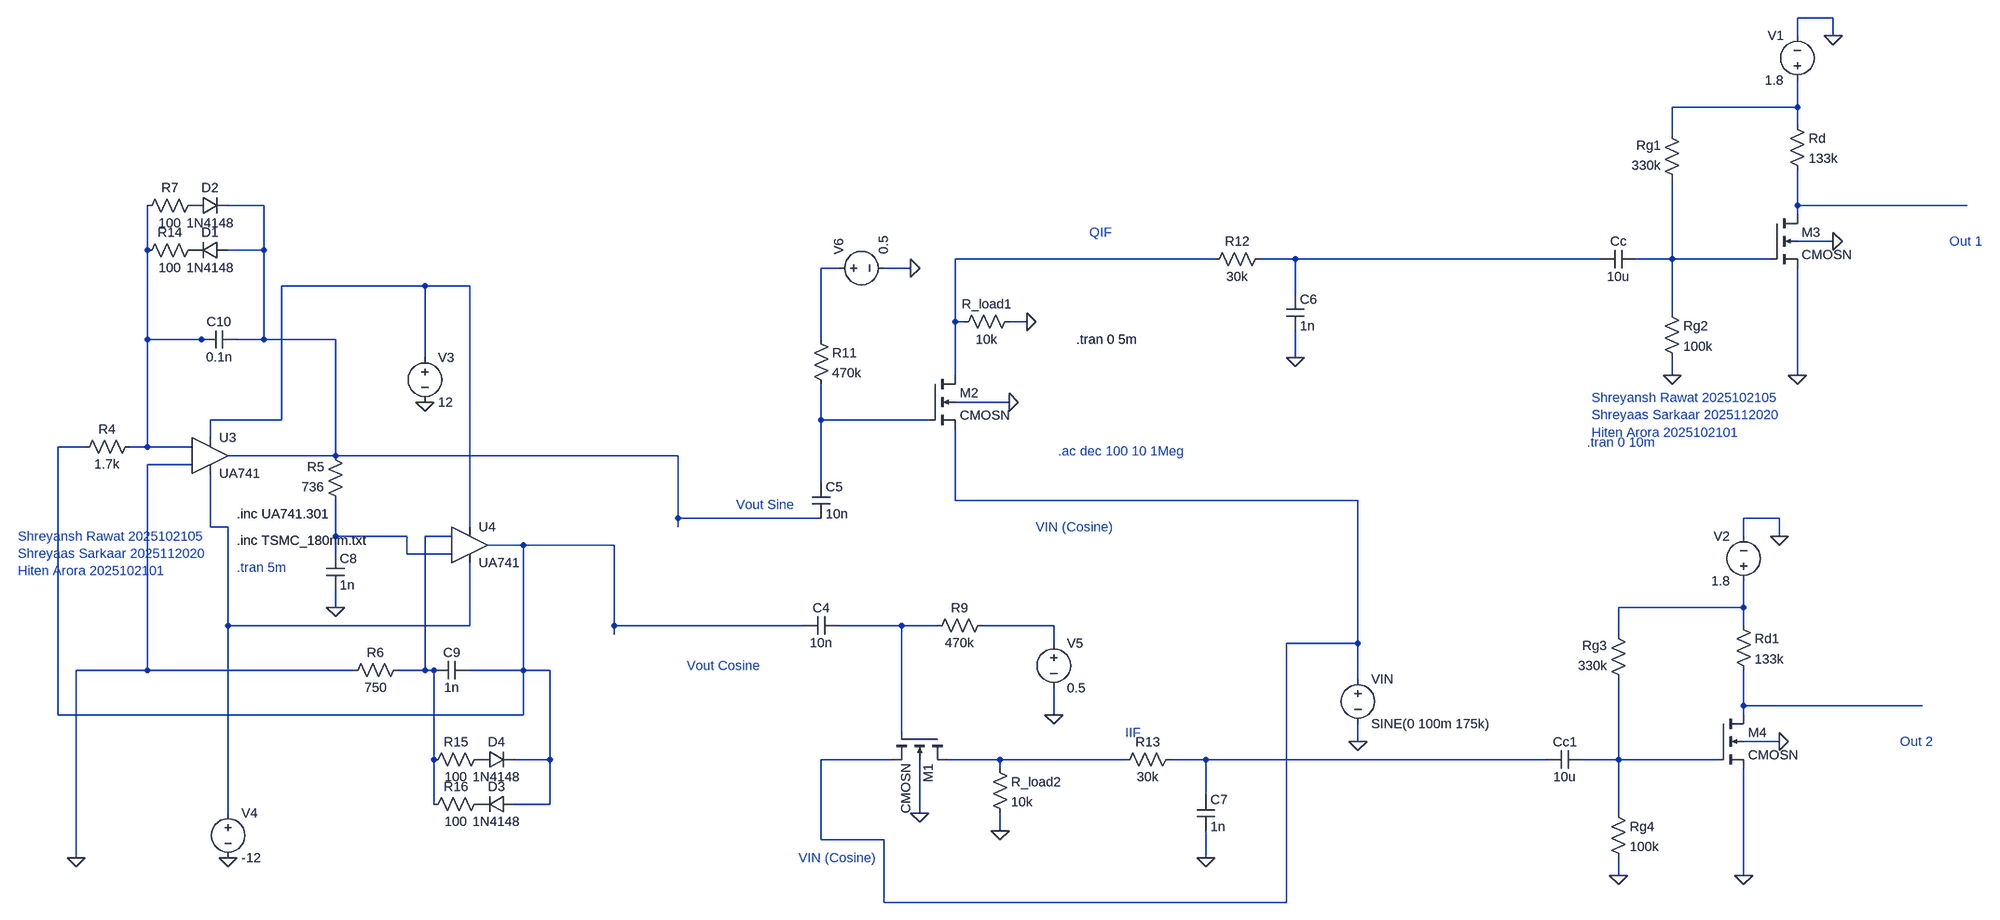
[diagram p0: schematic qdc_full_system.asc]
qdc_full_system.asc, the LTspice schematic file:
Version 4.1
SHEET 1 5124 900
WIRE 3616 -688 3552 -688
WIRE 3552 -656 3552 -688
WIRE 3616 -656 3616 -688
WIRE 3552 -528 3552 -576
WIRE 3552 -528 3328 -528
WIRE 3552 -496 3552 -528
WIRE 3328 -480 3328 -528
WIRE 224 -352 160 -352
WIRE 3552 -352 3552 -416
WIRE 3856 -352 3552 -352
WIRE 3552 -336 3552 -352
WIRE 3616 -288 3552 -288
WIRE 16 -272 16 -352
WIRE 224 -272 224 -352
WIRE 224 -272 160 -272
WIRE 2400 -256 1936 -256
WIRE 2544 -256 2480 -256
WIRE 3200 -256 2544 -256
WIRE 3328 -256 3328 -400
WIRE 3328 -256 3264 -256
WIRE 3504 -256 3328 -256
WIRE 1728 -240 1696 -240
WIRE 1856 -240 1808 -240
WIRE 512 -208 256 -208
WIRE 592 -208 512 -208
WIRE 2544 -192 2544 -256
WIRE 3328 -160 3328 -256
WIRE 1936 -144 1936 -256
WIRE 1952 -144 1936 -144
WIRE 2064 -144 2032 -144
WIRE 16 -112 16 -272
WIRE 112 -112 16 -112
WIRE 128 -112 112 -112
WIRE 224 -112 224 -272
WIRE 224 -112 176 -112
WIRE 352 -112 224 -112
WIRE 1696 -112 1696 -240
WIRE 512 -80 512 -208
WIRE 2544 -80 2544 -128
WIRE 1936 -48 1936 -144
WIRE 3328 -48 3328 -80
WIRE 3552 -48 3552 -240
WIRE 2032 0 1936 0
WIRE 256 32 256 -208
WIRE 256 32 128 32
WIRE 1696 32 1696 -32
WIRE 1888 32 1696 32
WIRE 128 64 128 32
WIRE -96 80 -144 80
WIRE 16 80 16 -112
WIRE 16 80 -16 80
WIRE 96 80 16 80
WIRE 352 96 352 -112
WIRE 352 96 160 96
WIRE 1440 96 352 96
WIRE 96 112 16 112
WIRE 1696 144 1696 32
WIRE 1936 176 1936 48
WIRE 2656 176 1936 176
WIRE 1440 208 1440 96
WIRE 1696 208 1440 208
WIRE 3520 208 3456 208
WIRE 128 224 128 128
WIRE 160 224 128 224
WIRE 592 224 592 -208
WIRE 1440 224 1440 208
WIRE 352 240 352 176
WIRE 480 240 352 240
WIRE 560 240 512 240
WIRE 3456 240 3456 208
WIRE 3520 240 3520 208
WIRE 688 256 624 256
WIRE 1312 256 688 256
WIRE 352 272 352 240
WIRE 480 272 480 240
WIRE 560 272 480 272
WIRE 352 368 352 336
WIRE 3456 368 3456 320
WIRE 3456 368 3232 368
WIRE 160 400 160 224
WIRE 592 400 592 288
WIRE 592 400 160 400
WIRE 1312 400 1312 256
WIRE 1664 400 1312 400
WIRE 1840 400 1728 400
WIRE 1904 400 1840 400
WIRE 2112 400 1984 400
WIRE 3456 400 3456 368
WIRE 1312 416 1312 400
WIRE 3232 416 3232 368
WIRE 2112 432 2112 400
WIRE 2656 432 2656 176
WIRE 2656 432 2528 432
WIRE 16 480 16 112
WIRE 16 480 -112 480
WIRE 384 480 16 480
WIRE 512 480 512 240
WIRE 512 480 464 480
WIRE 528 480 512 480
WIRE 688 480 688 256
WIRE 688 480 592 480
WIRE 736 480 688 480
WIRE 2656 496 2656 432
WIRE 3456 544 3456 480
WIRE 3776 544 3456 544
WIRE -144 560 -144 80
WIRE 688 560 688 480
WIRE 688 560 -144 560
WIRE 2112 560 2112 512
WIRE 3456 560 3456 544
WIRE 1840 592 1840 400
WIRE 2656 608 2656 576
WIRE 3520 608 3456 608
WIRE 528 640 528 480
WIRE 736 640 736 480
WIRE 736 640 672 640
WIRE 1824 640 1696 640
WIRE 2016 640 1920 640
WIRE 2240 640 2016 640
WIRE 2384 640 2320 640
WIRE 3104 640 2384 640
WIRE 3232 640 3232 496
WIRE 3232 640 3168 640
WIRE 3408 640 3232 640
WIRE 2016 656 2016 640
WIRE 2384 704 2384 640
WIRE 528 720 528 640
WIRE 736 720 736 640
WIRE 736 720 672 720
WIRE 160 736 160 400
WIRE 1872 736 1872 640
WIRE 3232 736 3232 640
WIRE 2016 768 2016 736
WIRE 1696 784 1696 640
WIRE 1808 784 1696 784
WIRE -112 816 -112 480
WIRE 2384 816 2384 768
WIRE 3232 848 3232 816
WIRE 3456 848 3456 656
WIRE 1808 896 1808 784
WIRE 2528 896 2528 432
WIRE 2528 896 1808 896
FLAG 1872 736 0
FLAG 2016 768 0
FLAG 2112 560 0
FLAG 2032 0 0
FLAG 2064 -144 0
FLAG 1856 -240 0
FLAG 2384 816 0
FLAG 2656 608 0
FLAG 352 368 0
FLAG 512 0 0
FLAG -112 816 0
FLAG 160 816 0
FLAG 3616 -656 0
FLAG 3616 -288 0
FLAG 3552 -48 0
FLAG 3328 -48 0
FLAG 3520 240 0
FLAG 3520 608 0
FLAG 3456 848 0
FLAG 3232 848 0
FLAG 2544 -80 0
DATAFLAG 3232 640 ""
DATAFLAG 3456 544 ""
DATAFLAG 2976 -256 ""
SYMBOL nmos4 1920 592 R90
SYMATTR InstName M1
SYMATTR Value CMOSN
SYMATTR Value2 l=180n w=2u ad=1.2p as=1.2p pd=5.2u ps=5.2u
SYMBOL res 2000 640 R0
SYMATTR InstName R_load2
SYMATTR Value 10k
SYMBOL res 2000 384 R90
WINDOW 0 0 56 VBottom 2
WINDOW 3 32 56 VTop 2
SYMATTR InstName R9
SYMATTR Value 470k
SYMBOL cap 1728 384 R90
WINDOW 0 0 32 VBottom 2
WINDOW 3 32 32 VTop 2
SYMATTR InstName C4
SYMATTR Value 10n
SYMBOL voltage 2112 416 R0
WINDOW 123 0 0 Left 0
WINDOW 39 0 0 Left 0
SYMATTR InstName V5
SYMATTR Value 0.5
SYMBOL nmos4 1888 -48 R0
SYMATTR InstName M2
SYMATTR Value CMOSN
SYMATTR Value2 l=180n w=2u ad=1.2p as=1.2p pd=5.2u ps=5.2u
SYMBOL res 1936 -128 R270
WINDOW 0 32 56 VTop 2
WINDOW 3 0 56 VBottom 2
SYMATTR InstName R_load1
SYMATTR Value 10k
SYMBOL res 1680 -128 R0
SYMATTR InstName R11
SYMATTR Value 470k
SYMBOL cap 1680 144 R0
SYMATTR InstName C5
SYMATTR Value 10n
SYMBOL voltage 1712 -240 R270
WINDOW 123 0 0 Left 0
WINDOW 39 0 0 Left 0
SYMATTR InstName V6
SYMATTR Value 0.5
SYMBOL voltage 2656 480 R0
WINDOW 123 24 124 Left 2
WINDOW 39 0 0 Left 0
SYMATTR InstName VIN
SYMATTR Value SINE(0 100m 175k)
SYMBOL res 2496 -272 R90
WINDOW 0 0 56 VBottom 2
WINDOW 3 32 56 VTop 2
SYMATTR InstName R12
SYMATTR Value 30k
SYMBOL cap 2528 -192 R0
SYMATTR InstName C6
SYMATTR Value 1n
SYMBOL res 2336 624 R90
WINDOW 0 0 56 VBottom 2
WINDOW 3 32 56 VTop 2
SYMATTR InstName R13
SYMATTR Value 30k
SYMBOL cap 2368 704 R0
SYMATTR InstName C7
SYMATTR Value 1n
SYMBOL UA741 128 32 R0
SYMATTR InstName U3
SYMBOL UA741 592 192 R0
SYMATTR InstName U4
SYMBOL res 0 64 R90
WINDOW 0 0 56 VBottom 2
WINDOW 3 32 56 VTop 2
SYMATTR InstName R4
SYMATTR Value 1.7k
SYMBOL res 368 192 R180
WINDOW 0 36 76 Left 2
WINDOW 3 36 40 Left 2
SYMATTR InstName R5
SYMATTR Value 736
SYMBOL cap 336 272 R0
SYMATTR InstName C8
SYMATTR Value 1n
SYMBOL res 480 464 R90
WINDOW 0 0 56 VBottom 2
WINDOW 3 32 56 VTop 2
SYMATTR InstName R6
SYMATTR Value 750
SYMBOL cap 592 464 R90
WINDOW 0 0 32 VBottom 2
WINDOW 3 32 32 VTop 2
SYMATTR InstName C9
SYMATTR Value 1n
SYMBOL cap 176 -128 R90
WINDOW 0 0 32 VBottom 2
WINDOW 3 32 32 VTop 2
SYMATTR InstName C10
SYMATTR Value 0.1n
SYMBOL voltage 512 -96 R0
WINDOW 123 0 0 Left 0
WINDOW 39 0 0 Left 0
SYMATTR InstName V3
SYMATTR Value 12
SYMBOL voltage 160 720 R0
WINDOW 123 0 0 Left 0
WINDOW 39 0 0 Left 0
SYMATTR InstName V4
SYMATTR Value -12
SYMBOL diode 160 -288 R90
WINDOW 0 0 32 VBottom 2
WINDOW 3 32 32 VTop 2
SYMATTR InstName D1
SYMATTR Value 1N4148
SYMBOL diode 96 -336 R270
WINDOW 0 32 32 VTop 2
WINDOW 3 0 32 VBottom 2
SYMATTR InstName D2
SYMATTR Value 1N4148
SYMBOL diode 672 704 R90
WINDOW 0 0 32 VBottom 2
WINDOW 3 32 32 VTop 2
SYMATTR InstName D3
SYMATTR Value 1N4148
SYMBOL diode 608 656 R270
WINDOW 0 32 32 VTop 2
WINDOW 3 0 32 VBottom 2
SYMATTR InstName D4
SYMATTR Value 1N4148
SYMBOL res 112 -368 R90
WINDOW 0 0 56 VBottom 2
WINDOW 3 32 56 VTop 2
SYMATTR InstName R7
SYMATTR Value 100
SYMBOL res 112 -288 R90
WINDOW 0 0 56 VBottom 2
WINDOW 3 32 56 VTop 2
SYMATTR InstName R14
SYMATTR Value 100
SYMBOL res 624 624 R90
WINDOW 0 0 56 VBottom 2
WINDOW 3 32 56 VTop 2
SYMATTR InstName R15
SYMATTR Value 100
SYMBOL res 624 704 R90
WINDOW 0 0 56 VBottom 2
WINDOW 3 32 56 VTop 2
SYMATTR InstName R16
SYMATTR Value 100
SYMBOL nmos4 3504 -336 R0
SYMATTR InstName M3
SYMATTR Value CMOSN
SYMATTR Value2 l=180n w=20u ad=12p as=12p pd=41.2u ps=41.2u
SYMBOL voltage 3552 -560 R180
WINDOW 0 24 96 Left 2
WINDOW 3 24 16 Left 2
WINDOW 123 0 0 Left 0
WINDOW 39 0 0 Left 0
SYMATTR InstName V1
SYMATTR Value 1.8
SYMBOL res 3536 -512 R0
SYMATTR InstName Rd
SYMATTR Value 133k
SYMBOL res 3344 -384 R180
WINDOW 0 36 76 Left 2
WINDOW 3 36 40 Left 2
SYMATTR InstName Rg1
SYMATTR Value 330k
SYMBOL res 3312 -176 R0
SYMATTR InstName Rg2
SYMATTR Value 100k
SYMBOL cap 3264 -272 R90
WINDOW 0 0 32 VBottom 2
WINDOW 3 32 32 VTop 2
SYMATTR InstName Cc
SYMATTR Value 10u
SYMBOL nmos4 3408 560 R0
SYMATTR InstName M4
SYMATTR Value CMOSN
SYMATTR Value2 l=180n w=20u ad=12p as=12p pd=41.2u ps=41.2u
SYMBOL voltage 3456 336 R180
WINDOW 0 24 96 Left 2
WINDOW 3 24 16 Left 2
WINDOW 123 0 0 Left 0
WINDOW 39 0 0 Left 0
SYMATTR InstName V2
SYMATTR Value 1.8
SYMBOL res 3440 384 R0
SYMATTR InstName Rd1
SYMATTR Value 133k
SYMBOL res 3248 512 R180
WINDOW 0 36 76 Left 2
WINDOW 3 36 40 Left 2
SYMATTR InstName Rg3
SYMATTR Value 330k
SYMBOL res 3216 720 R0
SYMATTR InstName Rg4
SYMATTR Value 100k
SYMBOL cap 3168 624 R90
WINDOW 0 0 32 VBottom 2
WINDOW 3 32 32 VTop 2
SYMATTR InstName Cc1
SYMATTR Value 10u
TEXT 1544 184 Left 2 ;Vout Sine
TEXT 1456 472 Left 2 ;Vout Cosine
TEXT 176 248 Left 2 !.inc TSMC_180nm.txt
TEXT 176 200 Left 2 !.inc UA741.301
TEXT 2176 -304 Left 2 ;QIF
TEXT 2240 592 Left 2 ;IIF
TEXT 2080 224 Left 2 ;VIN (Cosine)
TEXT 1656 816 Left 2 ;VIN (Cosine)
TEXT 3824 -288 Left 2 ;Out 1
TEXT 3736 608 Left 2 ;Out 2
TEXT 176 296 Left 2 ;.tran 5m
TEXT -216 240 Left 2 ;Shreyansh Rawat 2025102105\nShreyaas Sarkaar 2025112020\nHiten Arora 2025102101
TEXT 2120 88 Left 2 ;.ac dec 100 10 1Meg
TEXT 2152 -112 Left 2 !.tran 0 5m
TEXT 3184 -8 Left 2 ;Shreyansh Rawat 2025102105\nShreyaas Sarkaar 2025112020\nHiten Arora 2025102101
TEXT 3176 72 Left 2 ;.tran 0 10m

The netlist it stands for:
* qdc_full_system.asc
M1 N020 N017 N012 0 CMOSN l=180n w=2u ad=1.2p as=1.2p pd=5.2u ps=5.2u
R_load2 N020 0 10k
R9 N018 N017 470k
C4 N017 N011 10n
V5 N018 0 0.5
M2 N005 N010 N012 0 CMOSN l=180n w=2u ad=1.2p as=1.2p pd=5.2u ps=5.2u
R_load1 N005 0 10k
R11 N008 N010 470k
C5 N010 N002 10n
V6 N008 0 0.5
VIN N012 0 SINE(0 100m 175k)
R12 N006 N005 30k
C6 N006 0 1n
R13 N021 N020 30k
C7 N021 0 1n
X§U3 0 N004 N009 N013 N002 UA741  ; pins In+ In- V+ V- OUT
X§U4 N014 N015 N009 N013 N011 UA741  ; pins In+ In- V+ V- OUT
R4 N004 N011 1.7k
R5 N014 N002 736
C8 N014 0 1n
R6 N015 0 750
C9 N011 N015 1n
C10 N002 N004 0.1n
V3 N009 0 12
V4 N013 0 -12
D1 N002 P001 1N4148
D2 P002 N002 1N4148
D3 N011 P003 1N4148
D4 P004 N011 1N4148
R7 P002 N004 100
R14 P001 N004 100
R15 P004 N015 100
R16 P003 N015 100
M3 N003 N007 0 0 CMOSN l=180n w=20u ad=12p as=12p pd=41.2u ps=41.2u
V1 N001 0 1.8
Rd N001 N003 133k
Rg1 N007 N001 330k
Rg2 N007 0 100k
Cc N007 N006 10u
M4 N019 N022 0 0 CMOSN l=180n w=20u ad=12p as=12p pd=41.2u ps=41.2u
V2 N016 0 1.8
Rd1 N016 N019 133k
Rg3 N022 N016 330k
Rg4 N022 0 100k
Cc1 N022 N021 10u
.model D D
.lib standard.dio
.model NMOS NMOS
.model PMOS PMOS
.lib standard.mos
* Vout Sine
* Vout Cosine
.inc TSMC_180nm.txt
.inc UA741.301
* QIF
* IIF
* VIN (Cosine)
* VIN (Cosine)
* Out 1
* Out 2
* .tran 5m
* Shreyansh Rawat 2025102105
* Shreyaas Sarkaar 2025112020
* Hiten Arora 2025102101
* .ac dec 100 10 1Meg
.tran 0 5m
* Shreyansh Rawat 2025102105
* Shreyaas Sarkaar 2025112020
* Hiten Arora 2025102101
* .tran 0 10m
.backanno
.end